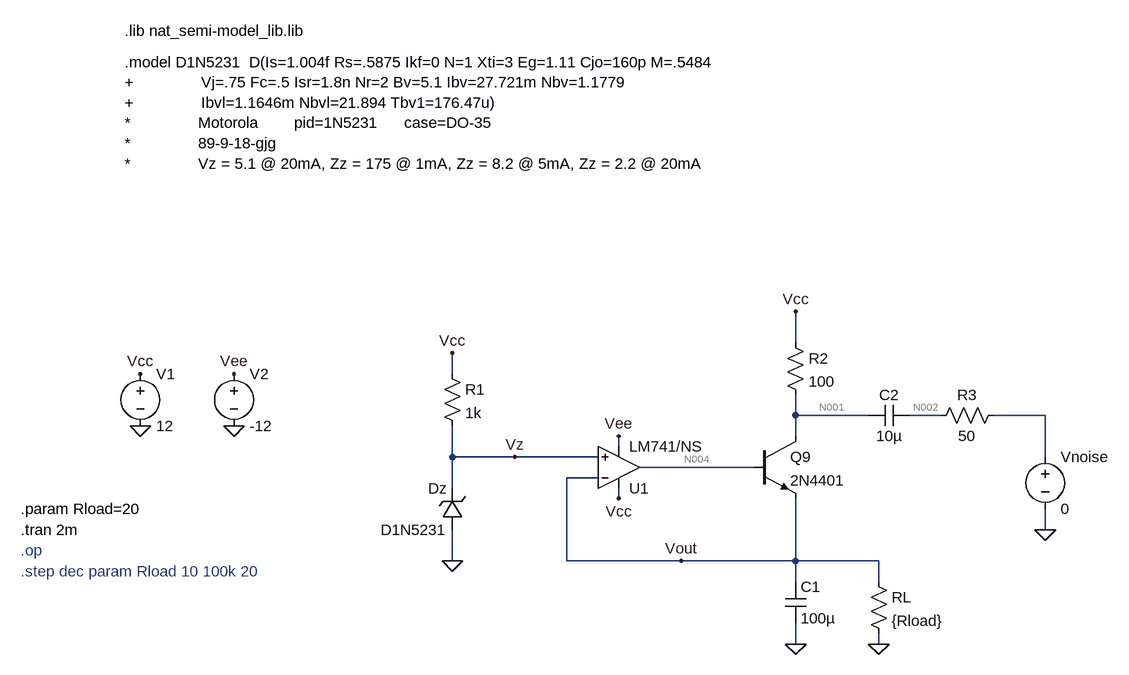
[diagram p0: schematic prelab.asc]
prelab.asc, the LTspice schematic file:
Version 4
SHEET 1 1448 932
WIRE 592 176 592 128
WIRE 64 224 64 192
WIRE 592 288 592 256
WIRE 704 288 592 288
WIRE 816 288 768 288
WIRE 976 288 896 288
WIRE 592 320 592 288
WIRE 320 336 320 320
WIRE 64 352 64 304
WIRE 160 352 64 352
WIRE 288 352 160 352
WIRE 976 352 976 288
WIRE 528 368 352 368
WIRE 288 384 240 384
WIRE 64 400 64 352
WIRE 320 416 320 400
WIRE 976 464 976 432
WIRE 64 512 64 464
WIRE 240 512 240 384
WIRE 416 512 240 512
WIRE 592 512 592 416
WIRE 592 512 416 512
WIRE 720 512 592 512
WIRE 592 544 592 512
WIRE 720 544 720 512
WIRE 592 640 592 608
WIRE 720 640 720 624
FLAG -416 304 0
FLAG -272 304 0
FLAG -416 224 Vcc
FLAG -272 224 Vee
FLAG 64 192 Vcc
FLAG 64 512 0
FLAG 592 640 0
FLAG 720 640 0
FLAG 976 464 0
FLAG 592 128 Vcc
FLAG 416 512 Vout
FLAG 160 352 Vz
FLAG 320 416 Vcc
FLAG 320 320 Vee
SYMBOL OpAmps\\opamp2 320 432 M180
SYMATTR InstName U1
SYMATTR Value LM741/NS
SYMBOL voltage -416 208 R0
SYMATTR InstName V1
SYMATTR Value 12
SYMBOL voltage -272 208 R0
SYMATTR InstName V2
SYMATTR Value -12
SYMBOL zener 80 464 R180
WINDOW 0 24 64 Left 2
WINDOW 3 24 0 Left 2
SYMATTR InstName Dz
SYMATTR Value D1N5231
SYMBOL res 48 208 R0
SYMATTR InstName R1
SYMATTR Value 1k
SYMBOL npn 528 320 R0
SYMATTR InstName Q9
SYMATTR Value 2N4401
SYMBOL res 576 160 R0
SYMATTR InstName R2
SYMATTR Value 100
SYMBOL cap 576 544 R0
SYMATTR InstName C1
SYMATTR Value 100µ
SYMBOL res 704 528 R0
SYMATTR InstName RL
SYMATTR Value {Rload}
SYMBOL cap 768 272 R90
WINDOW 0 0 32 VBottom 2
WINDOW 3 32 32 VTop 2
SYMATTR InstName C2
SYMATTR Value 10µ
SYMBOL res 912 272 R90
WINDOW 0 0 56 VBottom 2
WINDOW 3 32 56 VTop 2
SYMATTR InstName R3
SYMATTR Value 50
SYMBOL voltage 976 336 R0
SYMATTR InstName Vnoise
SYMATTR Value 0
TEXT -440 -304 Left 2 !.lib nat_semi-model_lib.lib
TEXT -440 -256 Left 2 !.model D1N5231  D(Is=1.004f Rs=.5875 Ikf=0 N=1 Xti=3 Eg=1.11 Cjo=160p M=.5484\n+               Vj=.75 Fc=.5 Isr=1.8n Nr=2 Bv=5.1 Ibv=27.721m Nbv=1.1779\n+               Ibvl=1.1646m Nbvl=21.894 Tbv1=176.47u)\n*               Motorola        pid=1N5231      case=DO-35\n*               89-9-18-gjg\n*               Vz = 5.1 @ 20mA, Zz = 175 @ 1mA, Zz = 8.2 @ 5mA, Zz = 2.2 @ 20mA
TEXT -600 528 Left 2 ;.step dec param Rload 10 100k 20
TEXT -600 496 Left 2 ;.op
TEXT -600 464 Left 2 !.tran 2m
TEXT -600 432 Left 2 !.param Rload=20

The netlist it stands for:
* prelab.asc
XU1 Vz Vout Vcc Vee N004 LM741/NS  ; pins In+ In- V+ V- OUT
V1 Vcc 0 12
V2 Vee 0 -12
Dz 0 Vz D1N5231
R1 Vcc Vz 1k
Q9 N001 N004 Vout 0 2N4401
R2 Vcc N001 100
C1 Vout 0 100µ
RL Vout 0 {Rload}
C2 N002 N001 10µ
R3 N003 N002 50
Vnoise N003 0 0
.model D D
.lib standard.dio
.model NPN NPN
.model PNP PNP
.lib standard.bjt
.lib nat_semi-model_lib.lib
.model D1N5231  D(Is=1.004f Rs=.5875 Ikf=0 N=1 Xti=3 Eg=1.11 Cjo=160p M=.5484
+               Vj=.75 Fc=.5 Isr=1.8n Nr=2 Bv=5.1 Ibv=27.721m Nbv=1.1779
+               Ibvl=1.1646m Nbvl=21.894 Tbv1=176.47u)
*               Motorola        pid=1N5231      case=DO-35
*               89-9-18-gjg
*               Vz = 5.1 @ 20mA, Zz = 175 @ 1mA, Zz = 8.2 @ 5mA, Zz = 2.2 @ 20mA
* .step dec param Rload 10 100k 20
* .op
.tran 2m
.param Rload=20
.backanno
.end

* Results of the author's LTspice run, read from the files saved beside the schematic
* Operating Point, zero values left out:
*   V(vout) = 2.395 V
*   V(vz) = 5.057 V
*   V(vee) = -12 V
*   V(vcc) = 12 V
*   V(n004) = 3.412 V
*   V(n001) = 2.5 V
*   Ic(Q9) = 95 mA
*   Ib(Q9) = 24.73 mA
*   Ie(Q9) = -119.7 mA
*   I(Dz) = -6.938 mA
*   I(R1) = 6.943 mA
*   I(R2) = 95 mA
*   I(Rl) = 119.7 mA
*   I(V1) = -128.2 mA
*   I(V2) = 1.55 mA
*   Ix(u1:1) = 5.464 µA
*   Ix(u1:2) = -5.304 µA
*   Ix(u1:99) = 26.28 mA
*   Ix(u1:50) = -1.55 mA
*   Ix(u1:28) = -24.73 mA
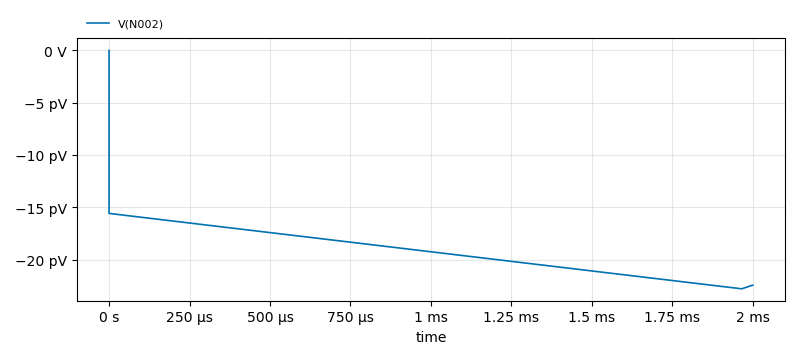
[diagram p1: Transient Analysis of prelab.asc, plotted from the saved traces]
* Transient Analysis, 1 run:
*   V(N002): min -22.79 pV, max 1.25 fV, average -19.25 pV, rms 19.58 pV, last -22.45 pV